# Altium project PCB_Project1.PrjPCB
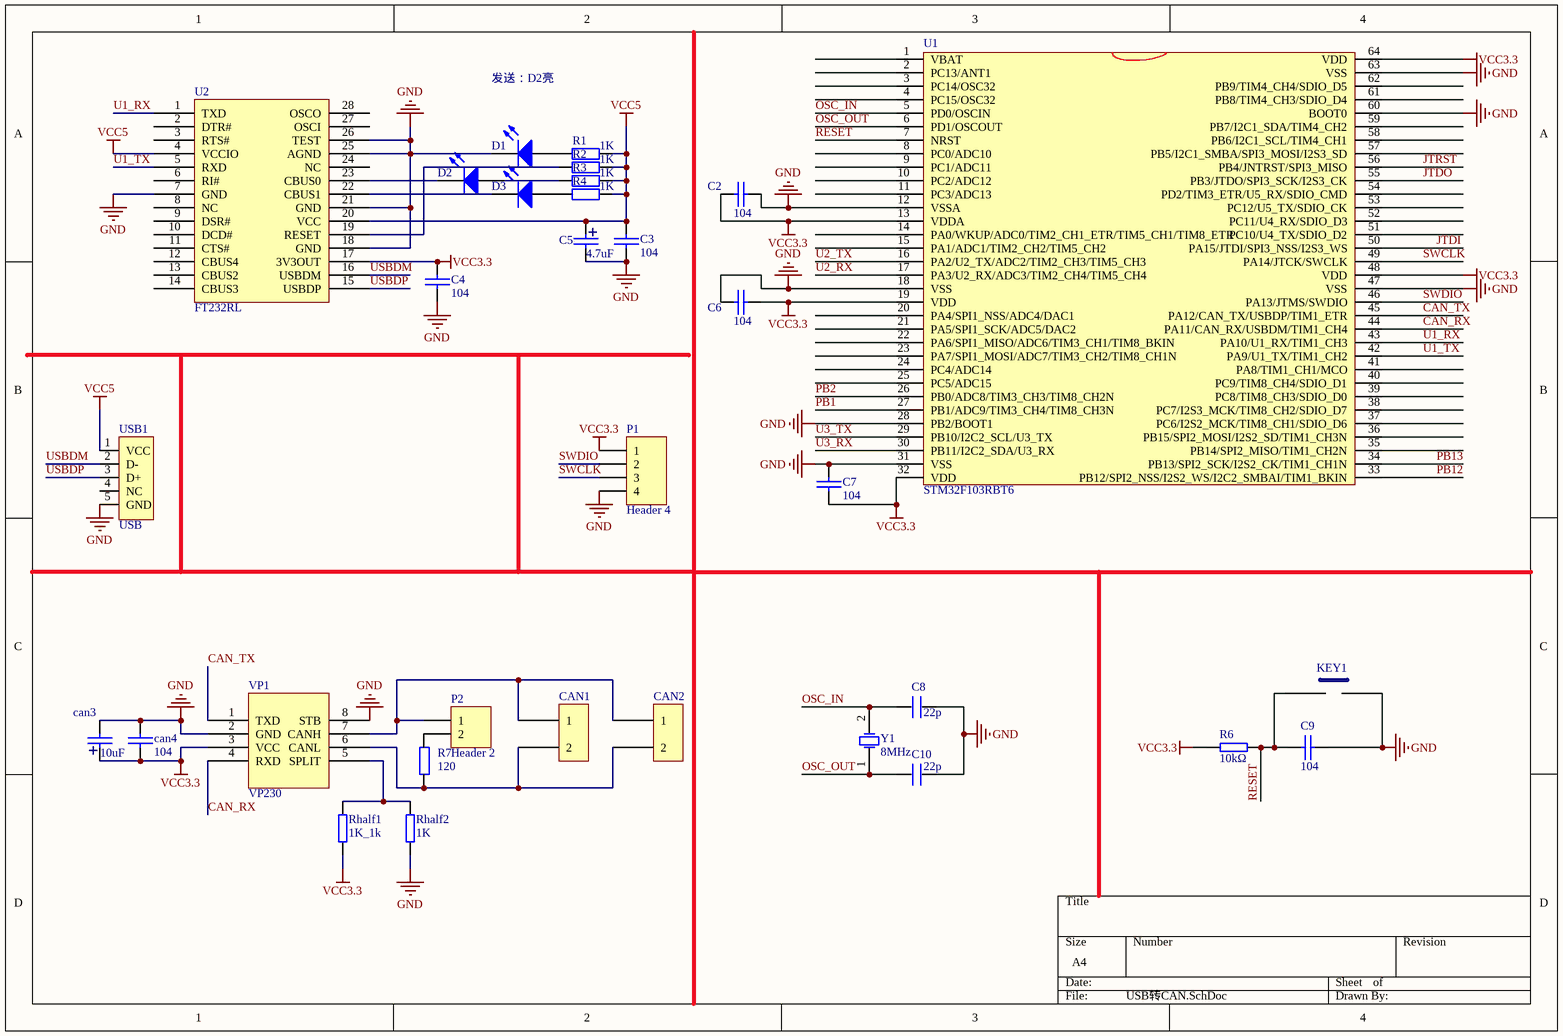
[diagram p0: USB转CAN.SchDoc]
1 sheet, 32 parts. Net scope: global (net labels, ports and power ports of the same name join across sheets).
Board file: USB转CAN.PcbDoc

## Sheet USB转CAN.SchDoc
size A4

### Parts
C2  104  [0603P]
C3  104  [0603P]
C4  104  [0603P]
C5  4.7uF  [1206]
C6  104  [0603P]
C7  104  [0603P]
C8  22p  [0603P]
C9  104  [0603P]
C10  22p  [0603P]
CAN1  2针端子  [CAN]  (value not drawn)
CAN2  2针端子  [CAN]  (value not drawn)
can3  10uF  [0603p]
can4  104  [0603p]
D1  LED2  [SMDLED]  (value not drawn)
D2  LED2  [SMDLED]  (value not drawn)
D3  LED2  [SMDLED]  (value not drawn)
KEY1  KEY2  [SW-PB]  (value not drawn)
P1  Header 4  [HDR1X4]
P2  Header 2  [HDR1X2]
R1  value 1K  [0603P]  (hidden comment: Res2)
R2  value 1K  [0603P]  (hidden comment: Res2)
R3  value 1K  [0603P]  (hidden comment: Res2)
R4  value 1K  [0603P]  (hidden comment: Res2)
R6  10kΩ  [0603P]
R7  120  [0805]
Rhalf1  1K_1k  [0603p]
Rhalf2  1K  [0603p]
U1  STM32F103RBT6  [TQFP-64]
U2  FT232RL  [SSOP-28]
USB1  USB  [USB]
VP1  VP230  [VP230]
Y1  8MHz  [XTAL_US]

### Nets
GND: C2.1 C3.2 C4.2 C5.2 C6.2 C7.2 C8.2 C9.2 C10.2 can3.2 can4.1 D1.2(K) KEY1.1 P1.4 Rhalf2.1 U1.12(VSSA) U1.18(VSS) U1.28(PB2/BOOT1) U1.31(VSS) U1.47(VSS) U1.60(BOOT0) U1.63(VSS) U2.7(GND) U2.18(GND) U2.21(GND) U2.25(AGND) U2.26(TEST) USB1.5(GND) VP1.2(GND) VP1.8(STB)
VCC3.3: C2.2 C4.1 C6.1 C7.1 can3.1 can4.2 P1.1 R6.2 Rhalf1.1 U1.13(VDDA) U1.19(VDD) U1.32(VDD) U1.48(VDD) U1.64(VDD) U2.17(3V3OUT) VP1.3(VCC)
VCC5: C3.1 C5.1 R1.2 R2.2 R3.2 R4.2 U2.4(VCCIO) U2.20(VCC) USB1.1(VCC)
CAN_RX: U1.44(PA11/CAN_RX/USBDM/TIM1_CH4) VP1.4(RXD)
CAN_TX: U1.45(PA12/CAN_TX/USBDP/TIM1_ETR) VP1.1(TXD)
JTDI: U1.50(PA15/JTDI/SPI3_NSS/I2S3_WS)
JTDO: U1.55(PB3/JTDO/SPI3_SCK/I2S3_CK)
JTRST: U1.56(PB4/JNTRST/SPI3_MISO)
OSC_IN: C8.1 U1.5(PD0/OSCIN) Y1.2(OSC2)
OSC_OUT: C10.1 U1.6(PD1/OSCOUT) Y1.1(OSC1)
PB1: U1.27(PB1/ADC9/TIM3_CH4/TIM8_CH3N)
PB2: U1.26(PB0/ADC8/TIM3_CH3/TIM8_CH2N)
PB12: U1.33(PB12/SPI2_NSS/I2S2_WS/I2C2_SMBAI/TIM1_BKIN)
PB13: U1.34(PB13/SPI2_SCK/I2S2_CK/TIM1_CH1N)
RESET: C9.1 KEY1.2 R6.1 U1.7(NRST)
SWCLK: P1.3 U1.49(PA14/JTCK/SWCLK)
SWDIO: P1.2 U1.46(PA13/JTMS/SWDIO)
U1_RX: U1.43(PA10/U1_RX/TIM1_CH3) U2.1(TXD)
U1_TX: U1.42(PA9/U1_TX/TIM1_CH2) U2.5(RXD)
U2_RX: U1.17(PA3/U2_RX/ADC3/TIM2_CH4/TIM5_CH4)
U2_TX: U1.16(PA2/U2_TX/ADC2/TIM2_CH3/TIM5_CH3)
U3_RX: U1.30(PB11/I2C2_SDA/U3_RX)
U3_TX: U1.29(PB10/I2C2_SCL/U3_TX)
USBDM: U2.16(USBDM) USB1.2(D-)
USBDP: U2.15(USBDP) USB1.3(D+)
NetCAN1_1: CAN1.1 CAN2.1 P2.1 VP1.7(CANH)
NetCAN1_2: CAN1.2 CAN2.2 R7.1 VP1.6(CANL)
NetD1_1: D1.1(A) R1.1
NetD2_1: D2.1(A) R3.1
NetD2_2: D2.2(K) U2.23(CBUS0)
NetD3_1: D3.1(A) R4.1
NetD3_2: D3.2(K) U2.22(CBUS1)
NetP2_2: P2.2 R7.2
NetR2_1: R2.1 U2.19(RESET)
NetRhalf1_2: Rhalf1.2 Rhalf2.2 VP1.5(SPLIT)

Not connected (* = marked no-connect by the designer): U1 1(VBAT) 2(PC13/ANT1) 3(PC14/OSC32) 4(PC15/OSC32) 8(PC0/ADC10) 9(PC1/ADC11) 10(PC2/ADC12) 11(PC3/ADC13) 14(PA0/WKUP/ADC0/TIM2_CH1_ETR/TIM5_CH1/TIM8_ETR) 15(PA1/ADC1/TIM2_CH2/TIM5_CH2) 20(PA4/SPI1_NSS/ADC4/DAC1) 21(PA5/SPI1_SCK/ADC5/DAC2) 22(PA6/SPI1_MISO/ADC6/TIM3_CH1/TIM8_BKIN) 23(PA7/SPI1_MOSI/ADC7/TIM3_CH2/TIM8_CH1N) 24(PC4/ADC14) 25(PC5/ADC15) 35(PB14/SPI2_MISO/TIM1_CH2N) 36(PB15/SPI2_MOSI/I2S2_SD/TIM1_CH3N) 37(PC6/I2S2_MCK/TIM8_CH1/SDIO_D6) 38(PC7/I2S3_MCK/TIM8_CH2/SDIO_D7) 39(PC8/TIM8_CH3/SDIO_D0) 40(PC9/TIM8_CH4/SDIO_D1) 41(PA8/TIM1_CH1/MCO) 51(PC10/U4_TX/SDIO_D2) 52(PC11/U4_RX/SDIO_D3) 53(PC12/U5_TX/SDIO_CK) 54(PD2/TIM3_ETR/U5_RX/SDIO_CMD) 57(PB5/I2C1_SMBA/SPI3_MOSI/I2S3_SD) 58(PB6/I2C1_SCL/TIM4_CH1) 59(PB7/I2C1_SDA/TIM4_CH2) 61(PB8/TIM4_CH3/SDIO_D4) 62(PB9/TIM4_CH4/SDIO_D5); U2 2(DTR#) 3(RTS#) 6(RI#) 8(NC) 9(DSR#) 10(DCD#) 11(CTS#) 12(CBUS4) 13(CBUS2) 14(CBUS3) 24(NC) 27(OSCI) 28(OSCO); USB1 4(NC)

### Notes on the sheet
- 发送：D2亮

### Library data of the parts
C2-C4 C6 C7 C9 can4 = CAP_WYN
C5 can3 = CAP_POL_WYN
C8 C10 = C
D1-D3 = LED2: Typical RED, GREEN, YELLOW, AMBER GaAs LED; Published: 8-Jun-2000; LatestRevisionDate: 17-Jul-2002; LatestRevisionNote: Re-released for DXP Platform.; PackageVersion: Feb-2002; PackageReference: 3.2X1.6X1.1; Publisher: Altium Limited; PackageDescription: SM LED; 2 Flat Leads
KEY1 = KEY
P1 = Header 4: Header, 4-Pin; LatestRevisionDate: 17-Jul-2002; LatestRevisionNote: Re-released for DXP Platform.; Publisher: Altium Limited
P2 = Header 2: Header, 2-Pin; LatestRevisionDate: 17-Jul-2002; LatestRevisionNote: Re-released for DXP Platform.; Publisher: Altium Limited
R1-R4 = Res2: Resistor; Published: 8-Jun-2000; LatestRevisionDate: 17-Jul-2002; LatestRevisionNote: Re-released for DXP Platform.; PackageReference: AXIAL-0.4; Publisher: Altium Limited; PackageDescription: Axial Device, Thru-Hole; 2 Leads; 0.4 in Pin Spacing
R6 Rhalf1 Rhalf2 = RES_WYN
R7 = R
U1 = STM32F103RDT6
Y1 = XTAL: Crystal Oscillator; Published: 8-Jun-2000; LatestRevisionDate: 17-Jul-2002; LatestRevisionNote: Re-released for DXP Platform.; Publisher: Altium Limited